# Altium schematic sheet 3_Radio.SchDoc
size A4
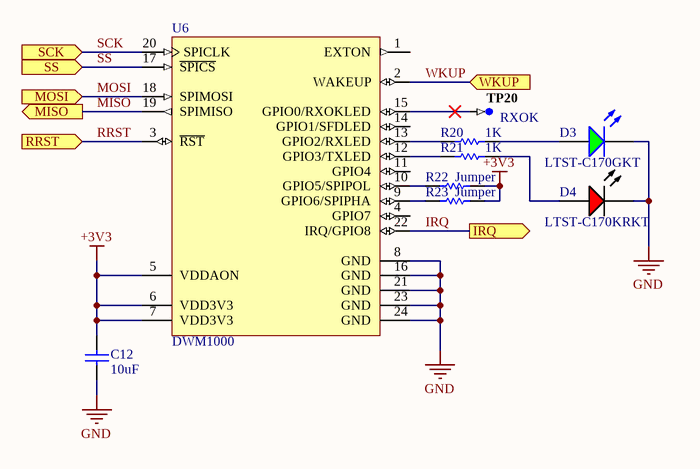
[diagram p0: 3_Radio.SchDoc]

## Parts
C12  10uF  [CAPC1206(3216)130_L]
D3  LTST-C170GKT  [LTST-C170GKT_V]
D4  LTST-C170KRKT  [LTST-C170KRKT_V]
R20  1K  [RESC0603(1608)_M]
R21  1K  [RESC0603(1608)_M]
R22  Jumper  [RESC0805(2012)_M]
R23  Jumper  [RESC0805(2012)_M]
TP20  RXOK  [TP-SM-C-100]  (no BOM)
U6  DWM1000  [DECW-DWM1000-24_V]

## Ports
IRQ (out), MISO (out), MOSI (in), RRST (in), SCK (in), SS (in), WKUP (in)

## Nets
+3V3: C12.2 R22.1 R23.1 U6.5(VDDAON) U6.6(VDD3V3) U6.7(VDD3V3)
GND: C12.1 D3.C D4.2(K) U6.8(GND) U6.16(GND) U6.21(GND) U6.23(GND) U6.24(GND)
IRQ: U6.22(IRQ/GPIO8) ; port IRQ
MISO: U6.19(SPIMISO) ; port MISO
MOSI: U6.18(SPIMOSI) ; port MOSI
RRST: U6.3(~{RST}) ; port RRST
SCK: U6.20(SPICLK) ; port SCK
SS: U6.17(~{SPICS}) ; port SS
WKUP: U6.2(WAKEUP) ; port WKUP
NetD3_A: D3.A R20.1
NetD4_1: D4.1(A) R21.1
NetR20_2: R20.2 U6.13(GPIO2/RXLED)
NetR21_2: R21.2 U6.12(GPIO3/TXLED)
NetR22_2: R22.2 U6.10(GPIO5/SPIPOL)
NetR23_2: R23.2 U6.9(GPIO6/SPIPHA)
NetTP20_1: TP20.1 U6.15(GPIO0/RXOKLED)

Not connected (* = marked no-connect by the designer): U6 1(EXTON) 4(GPIO7) 11(GPIO4) 14(GPIO1/SFDLED)

## Library data of the parts
C12 = CMP-1037-04977-1: CAP 10uF 16V -20% to +80% 1206 (3216 Metric) Thickness 1.3mm SMD; Case-EIA: 1206; Case-Metric: 3216; Rated Voltage: 16 V; Tolerance: -20% to +80%; Technology: SMT; Value: 10uF; Max Thickness: 1.3 mm
D3 = CMP-1674-00002-3: LED GREEN CLEAR 0805 SMD; Manufacturer: Lite-On; ComponentLink1URL: http://media.digikey.com/pdf/Data%20Sheets/Lite-On%20PDFs/LTST-C170GKT.pdf; PackageReference: C170GKT; ComponentLink1Description: Datasheet; PartNumber: LTST-C170GKT
D4 = CMP-2000-07593-1: LED Red, 75 mW, 54 mcd, -55 to 85 degC, 2-Pin SMD, RoHS, Tape and Reel; Manufacturer: Lite-On; Lens Transparency: Clear; Number of Elements: 1; Power Rating: 75mW; Luminous Intensity: 54mcd; Viewing Angle: 130degrees; Forward Current: 30mA; Wavelength: 639nm; Lens Style: Rectangular; Case\/Package: 0805; Test Current: 20mA; Dominant Wavelength: 631nm; Forward Voltage: 2V; Lens Colour: Colorless; Min Operating Temperature: -55degC; RoHSCompliant: True; Length: 3.2mm; Width: 1.25mm; Mount: SurfaceMount; Packaging: TapeandReel; Number of LEDs: 1; Radiation Hardening: No; Datasheet URL: http://optoelectronics.liteon.com/upload/download/DS-22-99-0150/LTST-C170KRKT.pdf; Datasheet Version: Rev. D, 11/2014; Case Code (Metric): 2012; Height: 1.1mm; Number of Pins: 2; Package Description: 2-Pin Surface Mount Device, Body 2 x 1.25 mm; Manufacturer URL: http://www.us.liteon.com/; Lead Free: LeadFree; Illumination Colour: Red; Colour: Red; Case Code (Imperial): 0805; Max Operating Temperature: 85degC; Power Dissipation: 75mW; Mounting Technology: SurfaceMount; Package Reference: C170KRKT; Package Quantity: 1; Depth: 1.6mm
R20 R21 = CMP-1012-00510-1: 1K 0.1W 1% 0603 (1608 Metric)  SMD; Case-Metric: 1608; Case-EIA: 0603; Value: 1000.00 Ohm; Technology: SMT; Tolerance: 1 %; Power: 0.1 W
R22 R23 = CMP-1013-00001-1: Jumper 0805 (2012 Metric); Case-EIA: 0805; Value: 0.00 Ohm; Tolerance: None; Case-Metric: 2012; Technology: SMT; Power: None
TP20 = CMP-0484-00002-2: Test Point, Surface Mount, Circular, Pad Diameter 1 mm; Manufacturer: No Vendor; PartNumber: TP-SM-C-100
U6 = CMP-2000-05094-1: DW M1000 IEEE 802.15.4 -2011 UWB Transceiver Module; Manufacturer: Decawave; Voltage - Supply: 2.8V~3.6V; Protocol: IR-UWB; Featured Product: ScenSorDWM1000Module; Design Resources: DevelopmentToolSelector; Frequency: 3.5GHz~6.5GHz; Antenna Type: Integrated,Chip; Other Names: 1479-1002-2RUPF-G001A; Current - Receiving: 64mA; Data Rate: 6.8Mbps; Serial Interfaces: SPI; Current - Transmitting: 31mA; Modulation: BPM,BPSK; Standard Package: 500; Series: -; RF Family/Standard: 802.15.4; Operating Temperature: -40degC~85degC; Sensitivity: -; Packaging: Tape&Reel(TR); Datasheet Version: Rev. V1.0, 12/2015; Power - Output: -; Family: RFTransceiverModules; Memory Size: -; Package / Case: Module; Mounting Type: SurfaceMount; Datasheet URL: http://www.decawave.com/sites/default/files/resources/dwm1000-datasheet-v1.3.pdf; Online Catalog: ScenSorDWM1000Module; Category: RF/IFandRFID; Manufacturer URL: http://www.decawave.com/